# Altium schematic sheet POWER.SchDoc
size A4
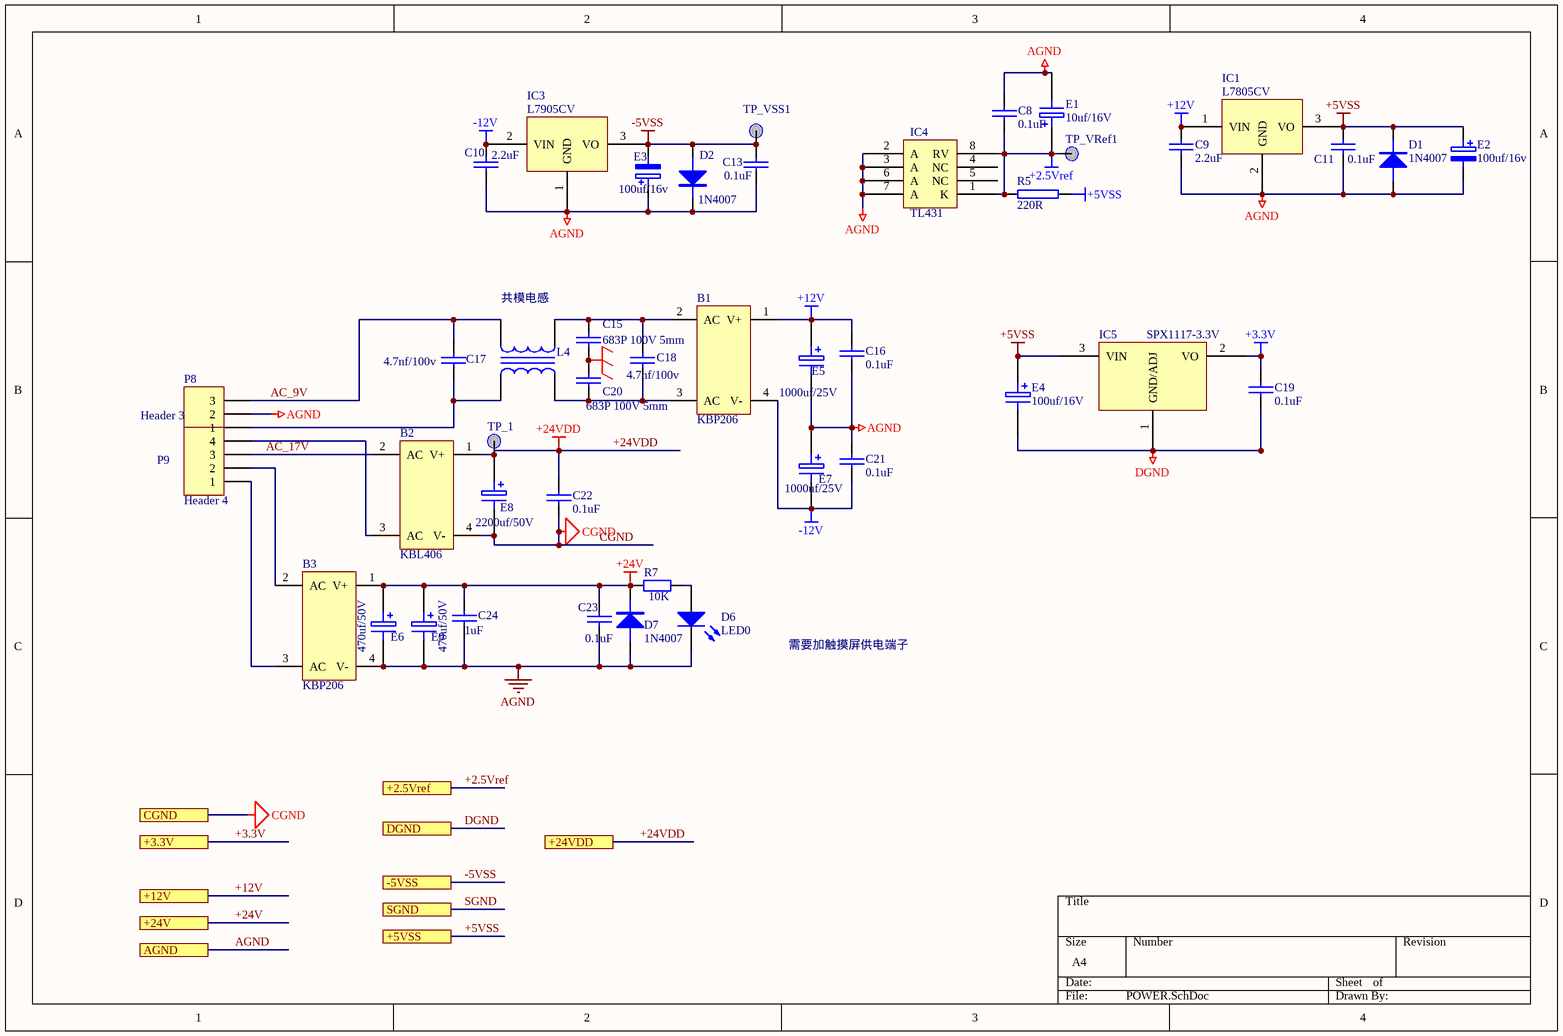
[diagram p0: POWER.SchDoc]

## Parts
B1  KBP206  [KBP206]
B2  KBL406  [KPL406]
B3  KBP206  [KBP206]
C8  0.1uF  [0805C]
C9  2.2uF  [0805C]
C10  2.2uF  [0805C]
C11  0.1uF  [0805C]
C13  0.1uF  [0805C]
C15  683P 100V 5mm  [CP1]
C16  0.1uF  [0805C]
C17  4.7nf/100v  [CP1]
C18  4.7nf/100v  [CP1]
C19  0.1uF  [0805C]
C20  683P 100V 5mm  [CP1]
C21  0.1uF  [0805C]
C22  0.1uF  [0805C]
C23  0.1uF  [0805C]
C24  1uF  [0805C]
D1  1N4007  [SK24]
D2  1N4007  [SK24]
D6  LED0  [0805LED]
D7  1N4007  [SK24]
E1  10uf/16V  [3528]
E2  100uf/16v  [3528]
E3  100uf/16v  [3528]
E4  100uf/16V  [3528]
E5  1000uf/25V  [EC5.08-10.5]
E6  470uf/50V  [EC5.08-10.5]
E7  1000uf/25V  [EC5.08-10.5]
E8  2200uf/50V  [EC5.08-13.5]
E9  470uf/50V  [EC5.08-10.5]
IC1  L7805CV  [DPAK3]
IC3  L7905CV  [DPAK3]
IC4  TL431  [SO8]
IC5  SPX1117-3.3V  [SOT223]
L4  共模电感  [TRANS]
P8  Header 3  [CONN-TH-KF7.62-3P]
P9  Header 4  [CONN-TH_KF7.62-4P]
R5  220R  [0805R]
R7  10K  [0805R]
TP_1  (no value)  [TPP]
TP_VRef1  (no value)  [TPP]
TP_VSS1  (no value)  [TPP]

## Ports
+2.5Vref, +3.3V, +5VSS, +12V, +24V, +24VDD, -5VSS, AGND, CGND, DGND, SGND

## Nets
+2.5Vref: C8.2 E1.1 IC4.1(K) IC4.8(RV) R5.1 TP_VRef1.1 ; port +2.5Vref
+3.3V: C19.1 IC5.2(VO) ; port +3.3V
+5VSS: C11.1 D1.2(K) E2.1 E4.1 IC1.3(VO) IC5.3(VIN) R5.2 ; port +5VSS
+12V: B1.1(V+) C9.1 C16.1 E5.1 IC1.1(VIN) ; port +12V
+24V: B3.1(V+) C23.1 C24.1 D7.2(K) E6.1 E9.1 R7.2 ; port +24V
+24VDD: B2.1(V+) C22.1 E8.1 TP_1.1 ; port +24VDD
-5VSS: C13.1 D2.1(A) E3.2 IC3.3(VO) TP_VSS1.1 ; port -5VSS
-12V: B1.4(V-) C10.1 C21.2 E7.2 IC3.2(VIN)
AGND: B3.4(V-) C8.1 C9.2 C10.2 C11.2 C13.2 C16.2 C21.1 C23.2 C24.2 D1.1(A) D2.2(K) D6.2(K) D7.1(A) E1.2 E2.2 E3.1 E5.2 E6.2 E7.1 E9.2 IC1.2(GND) IC3.1(GND) IC4.2(A) IC4.3(A) IC4.6(A) IC4.7(A) P8.2 ; port AGND
CGND: B2.4(V-) C22.2 E8.2 ; port CGND
DGND: C19.2 E4.2 IC5.1(GND/ADJ) ; port DGND
EGND: C15.2 C20.1
AC_9V: C17.1 L4.2 P8.3
AC_17V: B2.2(AC) P9.3
SGND: port SGND
NetB1_2: B1.2(AC) C15.1 C18.1 L4.4
NetB1_3: B1.3(AC) C18.2 C20.2 L4.3
NetB2_3: B2.3(AC) P9.4
NetB3_2: B3.2(AC) P9.2
NetB3_3: B3.3(AC) P9.1
NetC17_2: C17.2 L4.1 P8.1
NetD6_1: D6.1(A) R7.1

Not connected (* = marked no-connect by the designer): IC4 4(NC) 5(NC)

## Notes on the sheet
- 需要加触摸屏供电端子

## Library data of the parts
B1 B3 = BRIDGE: 品牌： MDD  型号： KBP206  直流反向耐压(Vr)：600V 平均整流电流(Io)：2A 正向压降(Vf)：1.1V@2A 正向浪涌电流(Ifsm)：60A
B2 = BRIDGE: 品牌： MDD  型号： KBL406  直流反向耐压(Vr)：600V 平均整流电流(Io)：4A 正向压降(Vf)：1V@4A 正向浪涌电流(Ifsm)：125A
C8 = CAP
C9 C10 = Cap: 品牌： SAMSUNG(三星) 型号： CL21B225KAFNNNE 容值：2.2uF 精度：±10% 额定电压：25V 材质(温度系数)：X7R 材质:X7R; Value: 104P
C11 C22 = Cap: 品牌： SAMSUNG(三星) 型号： CL21B104KBCNNNC ：容值：100nF 精度：±10% 额定电压：50V 材质(温度系数)：X7R 材质:X7R; Value: 104P
C13 C16 = Cap: 品牌： SAMSUNG(三星)    型号： CL10B104KB8NNNC  容值：100nF 精度：±10% 额定电压：50V 材质(温度系数)：X7R 材质:X7R; Value: 104P
C15 C20 = Cap: 品牌： muRata(村田) 型号： RCER72A683K1K1H03B  容值：68nF 精度：±10% 额定电压：100V 温度系数：X7R; Value: 683P 100V 5mm
C17 = Cap: 品牌： muRata(村田) 品牌： muRata(村田)  容值：4.7nF 精度：±10% 额定电压：100V 温度系数：X7R; Value: 472P 100V 5mm
C18 = Cap: 品牌： muRata(村田) 品牌： muRata(村田)  容值：4.7nF 精度：±10% 额定电压：100V 温度系数：X7R; Value: 472P
C19 = CAP: Capacitor
C21 = Cap: 品牌： SAMSUNG(三星)    型号： CL10B104KB8NNNC  容值：100nF 精度：±10% 额定电压：50V 材质(温度系数)：X7R 材质:X7R
C23 = Cap: 品牌： SAMSUNG(三星) 型号： CL21B104KBCNNNC ：容值：100nF 精度：±10% 额定电压：50V 材质(温度系数)：X7R 材质:X7R; Value: 0.1uF
C24 = Cap: 品牌： SAMSUNG(三星) 型号： CL21B334KBFNNNE 容值：330nF 精度：±10% 额定电压：50V 材质(温度系数)：X7R 材质:X7R; Value: 0.33uF
D1 D2 D7 = DIODE: 品牌： TWGMC(台湾迪嘉) 型号： 1N4001 极管配置：独立式 直流反向耐压(Vr)：50V 平均整流电流(Io)：1A 正向压降(Vf)：1.1V@1A 二极管配置：独立式 直流反向耐压(Vr)：50V 平均整流电流(Io)：1A 正向压降(Vf)：1.1V@1A
D6 = LED0: 品牌： 国星光电 型号： NCD0805B2 发光颜色：蓝灯 贴片LED；0805蓝色；2012蓝色；透镜颜色：无色透明；发光角度：130°；功率：72mW；工作温度：-30℃~+85℃；; Published: 8-Jun-2000; LatestRevisionDate: 08-Jul-2005; LatestRevisionNote: Mech Layer 1 removed.; PackageReference: LED-0; Publisher: Altium Limited; PackageDescription: LED; 2 Leads
E1 = ELECTRO1: 品牌： Kyocera AVX 型号： TAJB106K016RNJ ：容值：10uF 精度：±10% 额定电压：16V 等效串联电阻：2.8Ω@100kHz
E2 E3 = ELECTRO2: 品牌： Kyocera AVX 型号： TAJB107M010RNJ  容值：100uF 精度：±20% 额定电压：10V 等效串联电阻：1.4Ω@100kHz; Value: 100uf/16V
E4 = ELECTRO1: Electrolytic Capacitor
E5 E7 = ELECTRO1: 品牌： CX(承兴) 型号： KM108M025G17RR0VH2FP0 容值：1000uF 精度：±20% 额定电压：25V; Value: 1000uf/25V
E6 E9 = ELECTRO1: 品牌： CX(承兴) 型号： KM108M025G17RR0VH2FP0 容值：1000uF 精度：±20% 额定电压：25V; Value: 1000uf/25V
E8 = ELECTRO1: 品牌： CX(承兴) 型号： KM228M050K30RR0VH2FP0 容值：2200uF 精度：±20% 额定电压：50V; Value: 2200uf/50V
IC1 = MC78XX: 品牌： UMW(友台半导体)  型号： L7805CV  输出类型：固定 输出极性：正 最大输入电压：35V 输出电压：5V 输出电流：1.2A
IC3 = MC79XX: 品牌： ST(意法半导体) 封装： TO-220 输出类型：固定 输出极性：负 最大输入电压：35V 输出电压：5V 输出电流：1.5A 电源纹波抑制比(PSRR)：60dB@(120Hz) 薄片 5.0V
IC4 = TL431-SO8: 品牌： JSMSEMI(杰盛微) 型号： TL431输出类型：可调 输入电压：37V 输出电压：2.5V~36V
IC5 = SPX1117
L4 = TRANS1: UF16 22mH 1.5A 12.5*10
P8 = Header 3: 品牌： KEFA(科发)  KF7.62-3p隔板类型：两面 间距：7.62mm 结构：1x2P 每排PIN数：2 排数：1 安装方式：直针 引脚位置：边脚 额定电流：24A 额定电压：450V 线规 - AWG：12~22 线规 - mm2：2.5 工作温度范围：-40℃~+105℃ 颜色：黑色 黑色; LatestRevisionDate: 17-Jul-2002; LatestRevisionNote: Re-released for DXP Platform.; Publisher: Altium Limited
P9 = Header 4: 品牌： KEFA(科发)  KF7.62-4p隔板类型：两面 间距：7.62mm 结构：1x2P 每排PIN数：2 排数：1 安装方式：直针 引脚位置：边脚 额定电流：24A 额定电压：450V 线规 - AWG：12~22 线规 - mm2：2.5 工作温度范围：-40℃~+105℃ 颜色：黑色 黑色; LatestRevisionDate: 17-Jul-2002; LatestRevisionNote: Re-released for DXP Platform.; Publisher: Altium Limited
R5 = RES2: 品牌： UNI-ROYAL(厚声) 型号： 0805W8J0221T5E 电阻类型：厚膜电阻 阻值：220Ω 精度：±5% 功率：125mW 温度系数：±100ppm/℃
R7 = Res2: 品牌： UNI-ROYAL(厚声) 型号： 0805W8F1002T5E 电阻类型：厚膜电阻 阻值：10kΩ 精度：±1% 功率：125mW 温度系数：±100ppm/℃; Published: 8-Jun-2000; LatestRevisionDate: 17-Jul-2002; LatestRevisionNote: Re-released for DXP Platform.; PackageReference: AXIAL-0.4; Publisher: Altium Limited; PackageDescription: Axial Device, Thru-Hole; 2 Leads; 0.4 in Pin Spacing; Value: 10K
TP_1 TP_VRef1 TP_VSS1 = TP